# Altium project TRACER_GBOX.PrjPcb
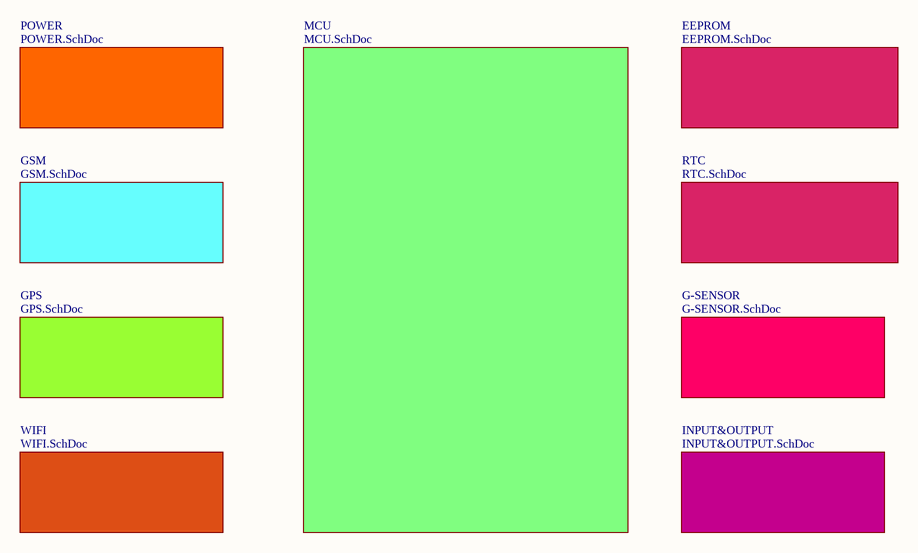
[diagram p0: TRACER_GBOX.SchDoc]
10 sheets, 122 parts. Net scope: flat (ports and power ports of the same name join across sheets).
Board file: TRACER_GBOX.PcbDoc
Sheets:
  TRACER_GBOX.SchDoc
    MCU = MCU.SchDoc
    EEPROM = EEPROM.SchDoc
    RTC = RTC.SchDoc
    GPS = GPS.SchDoc
    GSM = GSM.SchDoc
    G-SENSOR = G-SENSOR.SchDoc
    POWER = POWER.SchDoc
    INPUT&OUTPUT = INPUT&OUTPUT.SchDoc
    WIFI = WIFI.SchDoc

## Sheet TRACER_GBOX.SchDoc
size A4

### Sub-sheets
EEPROM = EEPROM.SchDoc: no entries
G-SENSOR = G-SENSOR.SchDoc: no entries
GPS = GPS.SchDoc: no entries
GSM = GSM.SchDoc: no entries
INPUT&OUTPUT = INPUT&OUTPUT.SchDoc: no entries
MCU = MCU.SchDoc: no entries
POWER = POWER.SchDoc: no entries
RTC = RTC.SchDoc: no entries
WIFI = WIFI.SchDoc: no entries

## Sheet MCU.SchDoc
size A4
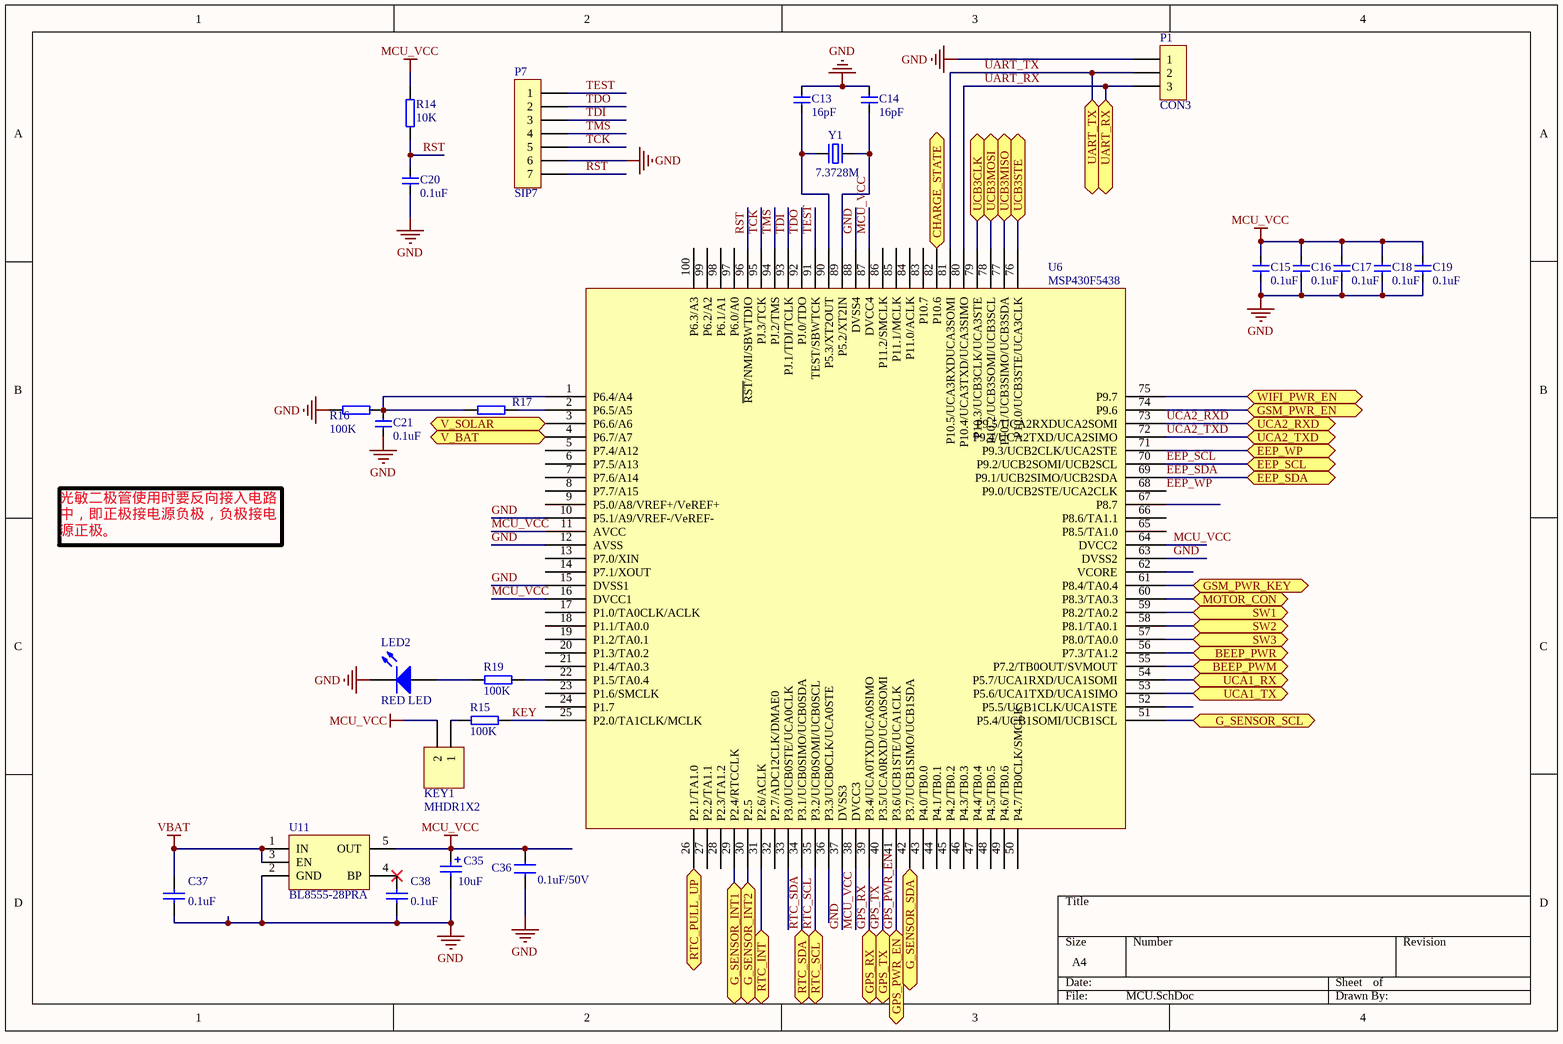
[diagram p1: MCU.SchDoc]

### Parts
C13  16pF  [0603C]
C14  16pF  [0603C]
C15  0.1uF  [0603C]
C16  0.1uF  [0603C]
C17  0.1uF  [0603C]
C18  0.1uF  [0603C]
C19  0.1uF  [0603C]
C20  0.1uF  [0603C]
C21  0.1uF  [0603C]
C35  10uF  [CAP1210]
C36  0.1uF/50V  [0603C]
C37  0.1uF  [0603C]
C38  0.1uF  [0603C]
KEY1  MHDR1X2  [MHDR1X2]
LED2  RED LED  [LED-0603]
P1  CON3  [HDR1X3]
P7  SIP7  [HDR1X7]
R14  10K  [0603R]
R15  100K  [0603R]
R16  100K  [0603R]
R17  200K  [0603R]
R19  100K  [0603R]
U6  MSP430F5438  [LQFP-100_14x14x05P]
U11  BL8555-28PRA  [SOT23-5]
Y1  7.3728M  [5032SMD]

### Ports
BEEP_PWM, BEEP_PWR, CHARGE_STATE, EEP_SCL, EEP_SDA, EEP_WP, G_SENSOR_INT1, G_SENSOR_INT2, G_SENSOR_SCL, G_SENSOR_SDA, GPS_PWR_EN, GPS_RX, GPS_TX, GSM_PWR_EN, GSM_PWR_KEY, MOTOR_CON, RTC_INT (bidir), RTC_PULL_UP, RTC_SCL, RTC_SDA, SW1, SW2, SW3, UART_RX, UART_TX, UCA1_RX, UCA1_TX, UCA2_RXD, UCA2_TXD, UCB3CLK, UCB3MISO, UCB3MOSI, UCB3STE, V_BAT, V_SOLAR, WIFI_PWR_EN

### Nets
GND: C13.1 C14.1 C15.1 C16.1 C17.1 C18.1 C19.1 C20.1 C21.2 C35.2 C36.2 C37.1 C38.1 LED2.2(K) P1.1 P7.6 R16.1 U6.10(P5.1/A9/VREF-/VeREF-) U6.12(AVSS) U6.15(DVSS1) U6.37(DVSS3) U6.63(DVSS2) U6.88(DVSS4) U11.2(GND)
MCU_VCC: C15.2 C16.2 C17.2 C18.2 C19.2 C35.1 C36.1 KEY1.2 R14.2 U6.11(AVCC) U6.16(DVCC1) U6.38(DVCC3) U6.64(DVCC2) U6.87(DVCC4) U11.5(OUT)
VBAT: C37.2 U11.1(IN) U11.3(EN)
BEEP_PWM: U6.55(P7.2/TB0OUT/SVMOUT) ; port BEEP_PWM
BEEP_PWR: U6.56(P7.3/TA1.2) ; port BEEP_PWR
EEP_SCL: U6.70(P9.2/UCB2SOMI/UCB2SCL) ; port EEP_SCL
EEP_SDA: U6.69(P9.1/UCB2SIMO/UCB2SDA) ; port EEP_SDA
EEP_WP: U6.68(P9.0/UCB2STE/UCA2CLK)
G_SENSOR_INT1: U6.29(P2.4/RTCCLK) ; port G_SENSOR_INT1
G_SENSOR_INT2: U6.30(P2.5) ; port G_SENSOR_INT2
GPS_PWR_EN: U6.41(P3.6/UCB1STE/UCA1CLK) ; port GPS_PWR_EN
GPS_RX: U6.39(P3.4/UCA0TXD/UCA0SIMO) ; port GPS_RX
GPS_TX: U6.40(P3.5/UCA0RXD/UCA0SOMI) ; port GPS_TX
GSM_PWR_EN: U6.74(P9.6) ; port GSM_PWR_EN
GSM_PWR_KEY: U6.61(P8.4/TA0.4) ; port GSM_PWR_KEY
KEY: R15.2 U6.25(P2.0/TA1CLK/MCLK)
MOTOR_CON: U6.60(P8.3/TA0.3) ; port MOTOR_CON
RST: C20.2 P7.7 R14.1 U6.96(~{RST}/NMI/SBWTDIO)
RTC_INT: U6.31(P2.6/ACLK) ; port RTC_INT
RTC_PULL_UP: U6.26(P2.1/TA1.0) ; port RTC_PULL_UP
RTC_SCL: U6.35(P3.2/UCB0SOMI/UCB0SCL) ; port RTC_SCL
RTC_SDA: U6.34(P3.1/UCB0SIMO/UCB0SDA) ; port RTC_SDA
TCK: P7.5 U6.95(PJ.3/TCK)
TDI: P7.3 U6.93(PJ.1/TDI/TCLK)
TDO: P7.2 U6.92(PJ.0/TDO)
TEST: P7.1 U6.91(TEST/SBWTCK)
TMS: P7.4 U6.94(PJ.2/TMS)
UART_RX: P1.3 U6.80(P10.4/UCA3TXD/UCA3SIMO) ; port UART_RX
UART_TX: P1.2 U6.81(P10.5/UCA3RXDUCA3SOMI) ; port UART_TX
UCA2_RXD: U6.73(P9.5/UCA2RXDUCA2SOMI) ; port UCA2_RXD
UCA2_TXD: U6.72(P9.4/UCA2TXD/UCA2SIMO) ; port UCA2_TXD
NetC1_2: U6.71(P9.3/UCB2CLK/UCA2STE) ; port EEP_WP
NetC13_2: C13.2 U6.90(P5.3/XT2OUT) Y1.1
NetC14_2: C14.2 U6.89(P5.2/XT2IN) Y1.2
NetC21_1: C21.1 R16.2 R17.1 U6.1(P6.4/A4)
NetC23_2: U6.3(P6.6/A6) ; port V_SOLAR
NetC28_1: U6.59(P8.2/TA0.2) ; port SW1
NetC29_1: U6.58(P8.1/TA0.1) ; port SW2
NetC30_1: U6.57(P8.0/TA0.0) ; port SW3
NetC38_2: C38.2 U11.4(BP)
NetC39_2: U6.4(P6.7/A7) ; port V_BAT
NetKEY1_1: KEY1.1 R15.1
NetLED2_1: LED2.1(A) R19.1
NetR17_2: R17.2 U6.2(P6.5/A5)
NetR19_2: R19.2 U6.22(P1.5/TA0.4)
NetR20_2: U6.75(P9.7) ; port WIFI_PWR_EN
NetR41_2: U6.51(P5.4/UCB1SOMI/UCB1SCL) ; port G_SENSOR_SCL
NetR42_2: U6.42(P3.7/UCB1SIMO/UCB1SDA) ; port G_SENSOR_SDA
NetRA1_5: U6.79(P10.3/UCB3CLK/UCA3STE) ; port UCB3CLK
NetRA1_6: U6.78(P10.2/UCB3SOMI/UCB3SCL) ; port UCB3MOSI
NetRA1_7: U6.77(P10.1/UCB3SIMO/UCB3SDA) ; port UCB3MISO
NetRA1_8: U6.76(P10.0/UCB3STE/UCA3CLK) ; port UCB3STE
NetU6_53: U6.53(P5.6/UCA1TXD/UCA1SIMO) ; port UCA1_TX
NetU6_54: U6.54(P5.7/UCA1RXD/UCA1SOMI) ; port UCA1_RX
NetU6_82: U6.82(P10.6) ; port CHARGE_STATE

Not connected (* = marked no-connect by the designer): U6 5(P7.4/A12) 6(P7.5/A13) 7(P7.6/A14) 8(P7.7/A15) 9(P5.0/A8/VREF+/VeREF+) 13(P7.0/XIN) 14(P7.1/XOUT) 17(P1.0/TA0CLK/ACLK) 18(P1.1/TA0.0) 19(P1.2/TA0.1) 20(P1.3/TA0.2) 21(P1.4/TA0.3) 23(P1.6/SMCLK) 24(P1.7) 27(P2.2/TA1.1) 28(P2.3/TA1.2) 32(P2.7/ADC12CLK/DMAE0) 33(P3.0/UCB0STE/UCA0CLK) 36(P3.3/UCB0CLK/UCA0STE) 43(P4.0/TB0.0) 44(P4.1/TB0.1) 45(P4.2/TB0.2) 46(P4.3/TB0.3) 47(P4.4/TB0.4) 48(P4.5/TB0.5) 49(P4.6/TB0.6) 50(P4.7/TB0CLK/SMCLK) 52(P5.5/UCB1CLK/UCA1STE) 62(VCORE) 65(P8.5/TA1.0) 66(P8.6/TA1.1) 67(P8.7) 83(P10.7) 84(P11.0/ACLK) 85(P11.1/MCLK) 86(P11.2/SMCLK) 97(P6.0/A0) 98(P6.1/A1) 99(P6.2/A2) 100(P6.3/A3)

### Notes on the sheet
- 光敏二极管使用时要反向接入电路中，即正极接电源负极，负极接电源正极。

### Library data of the parts
C13-C21 C36 = CAP
C35 = Cap Pol: Polarized Capacitor (Radial); Published: 8-Jun-2000; LatestRevisionDate: 17-Jul-2002; LatestRevisionNote: Re-released for DXP Platform.; Publisher: Altium Limited; Value: 10uF
C37 C38 = Cap: Capacitor; Value: 104; Published: 8-Jun-2000; LatestRevisionDate: 17-Jul-2002; LatestRevisionNote: Re-released for DXP Platform.; Publisher: Altium Limited
KEY1 = MHDR1X2: Header, 2-Pin; LatestRevisionDate: 17-Jul-2002; LatestRevisionNote: Re-released for DXP Platform.; Publisher: Altium Limited
LED2 = LED3: 红色LED; Published: 8-Jun-2000; LatestRevisionDate: 17-Dec-2003; LatestRevisionNote: PCB Footprint replaced.; DatasheetDocument: 16-Apr-2002; PackageDocument: 16-Apr-2002; PackageReference: 3.5X2.8X1.9; Publisher: Altium Limited
P1 = CON3: Connector
P7 = COM7
R14-R17 R19 = RES2A
U6 = MSP430F5438A
U11 = SGM2019
Y1 = CRYSTAL0.3: 5032 SMD 无源2pin

## Sheet EEPROM.SchDoc
size A4
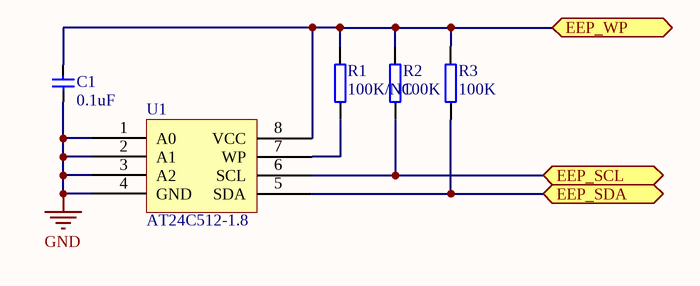
[diagram p2: EEPROM.SchDoc]

### Parts
C1  0.1uF  [0603C]
R1  100K/NC  [0603R]
R2  100K  [0603R]
R3  100K  [0603R]
U1  AT24C512-1.8  [SOP8]

### Ports
EEP_SCL, EEP_SDA, EEP_WP

### Nets
GND: C1.1 U1.1(A0) U1.2(A1) U1.3(A2) U1.4(GND)
EEP_SCL: R2.2 U1.6(SCL) ; port EEP_SCL
EEP_SDA: R3.2 U1.5(SDA) ; port EEP_SDA
NetC1_2: C1.2 R1.2 R2.1 R3.1 U1.8(VCC) ; port EEP_WP
NetR1_1: R1.1 U1.7(WP)

### Library data of the parts
C1 = CAP
R1-R3 = RES2A

## Sheet RTC.SchDoc
size A4
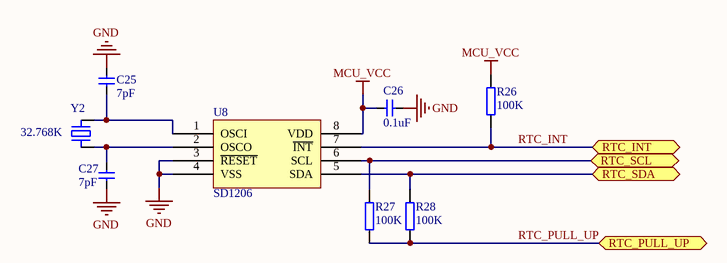
[diagram p3: RTC.SchDoc]

### Parts
C25  7pF  [0603C]
C26  0.1uF  [0603C]
C27  7pF  [0603C]
R26  100K  [0603R]
R27  100K  [0603R]
R28  100K  [0603R]
U8  SD1206  [SOP8]
Y2  32.768K  [3215SMD]

### Ports
RTC_INT, RTC_PULL_UP, RTC_SCL, RTC_SDA

### Nets
GND: C25.1 C26.2 C27.1 U8.3(~{RESET}) U8.4(VSS)
MCU_VCC: C26.1 R26.2 U8.8(VDD)
RTC_INT: R26.1 U8.7(~{INT}) ; port RTC_INT
RTC_PULL_UP: R27.1 R28.1 ; port RTC_PULL_UP
RTC_SCL: R27.2 U8.6(SCL) ; port RTC_SCL
RTC_SDA: R28.2 U8.5(SDA) ; port RTC_SDA
NetC25_2: C25.2 U8.1(OSCI) Y2.1
NetC27_2: C27.2 U8.2(OSCO) Y2.2

### Library data of the parts
C25-C27 = CAP
R26-R28 = RES2A
U8 = PCF8593
Y2 = CRYSTAL_2P: 无源贴片晶振 3215 2脚  FC-135

## Sheet GPS.SchDoc
size A4
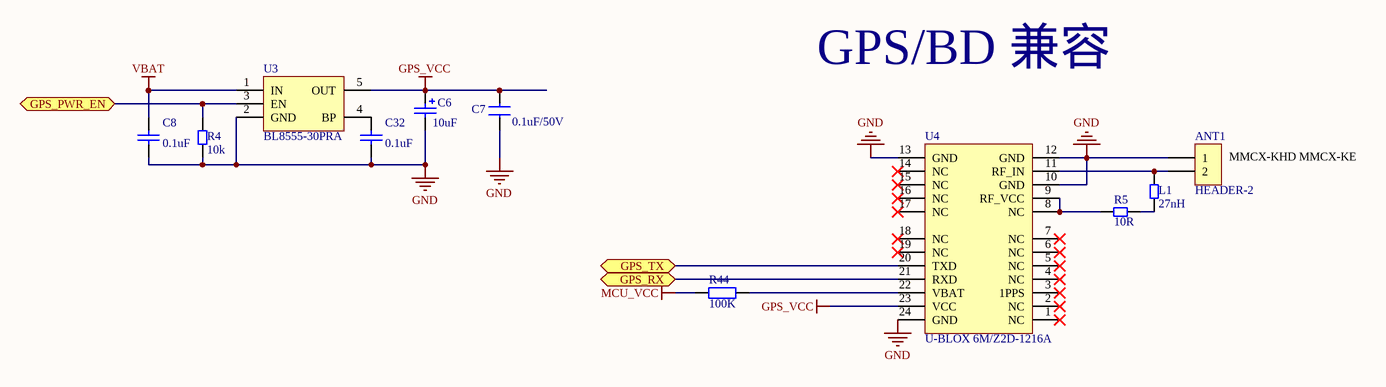
[diagram p4: GPS.SchDoc]

### Parts
ANT1  HEADER-2  [IPEX]
C6  10uF  [CAP1210]
C7  0.1uF/50V  [0603C]
C8  0.1uF  [0603C]
C32  0.1uF  [0603C]
L1  27nH  [0603R]
R4  10k  [0603R]
R5  10R  [1206R]
R44  100K  [0603R]
U3  BL8555-30PRA  [SOT23-5]
U4  U-BLOX 6M/Z2D-1216A  [G_UBLOXNEO5]

### Ports
GPS_PWR_EN, GPS_RX, GPS_TX

### Nets
GND: ANT1.1 C6.2 C7.2 C8.1 C32.1 R4.1 U3.2(GND) U4.10(GND) U4.12(GND) U4.13(GND) U4.24(GND)
GPS_VCC: C6.1 C7.1 U3.5(OUT) U4.23(VCC)
MCU_VCC: R44.1
VBAT: C8.2 U3.1(IN)
GPS_PWR_EN: R4.2 U3.3(EN) ; port GPS_PWR_EN
GPS_RX: U4.21(RXD) ; port GPS_RX
GPS_TX: U4.20(TXD) ; port GPS_TX
NetANT1_2: ANT1.2 L1.2 U4.11(RF_IN)
NetC32_2: C32.2 U3.4(BP)
NetL1_1: L1.1 R5.2
NetR5_1: R5.1 U4.8(NC) U4.9(RF_VCC)
NetR44_2: R44.2 U4.22(VBAT)

Not connected (* = marked no-connect by the designer): U4 1(NC)* 2(NC)* 3(1PPS)* 4(NC)* 5(NC)* 6(NC)* 7(NC)* 14(NC)* 15(NC)* 16(NC)* 17(NC)* 18(NC)* 19(NC)*

### Notes on the sheet
- GPS/BD 兼容
- (near ANT1) MMCX-KHD MMCX-KE

### Library data of the parts
C6 = Cap Pol: Polarized Capacitor (Radial); Published: 8-Jun-2000; LatestRevisionDate: 17-Jul-2002; LatestRevisionNote: Re-released for DXP Platform.; Publisher: Altium Limited; Value: 10uF
C7 = CAP
C8 C32 = Cap: Capacitor; Value: 104; Published: 8-Jun-2000; LatestRevisionDate: 17-Jul-2002; LatestRevisionNote: Re-released for DXP Platform.; Publisher: Altium Limited
L1 R4 R5 = Res2: Resistor; Value: 1K; Published: 8-Jun-2000; LatestRevisionDate: 17-Jul-2002; LatestRevisionNote: Re-released for DXP Platform.; Publisher: Altium Limited
R44 = 0603R
U3 = SGM2019
U4 = XBDM-1612

## Sheet GSM.SchDoc
size A4
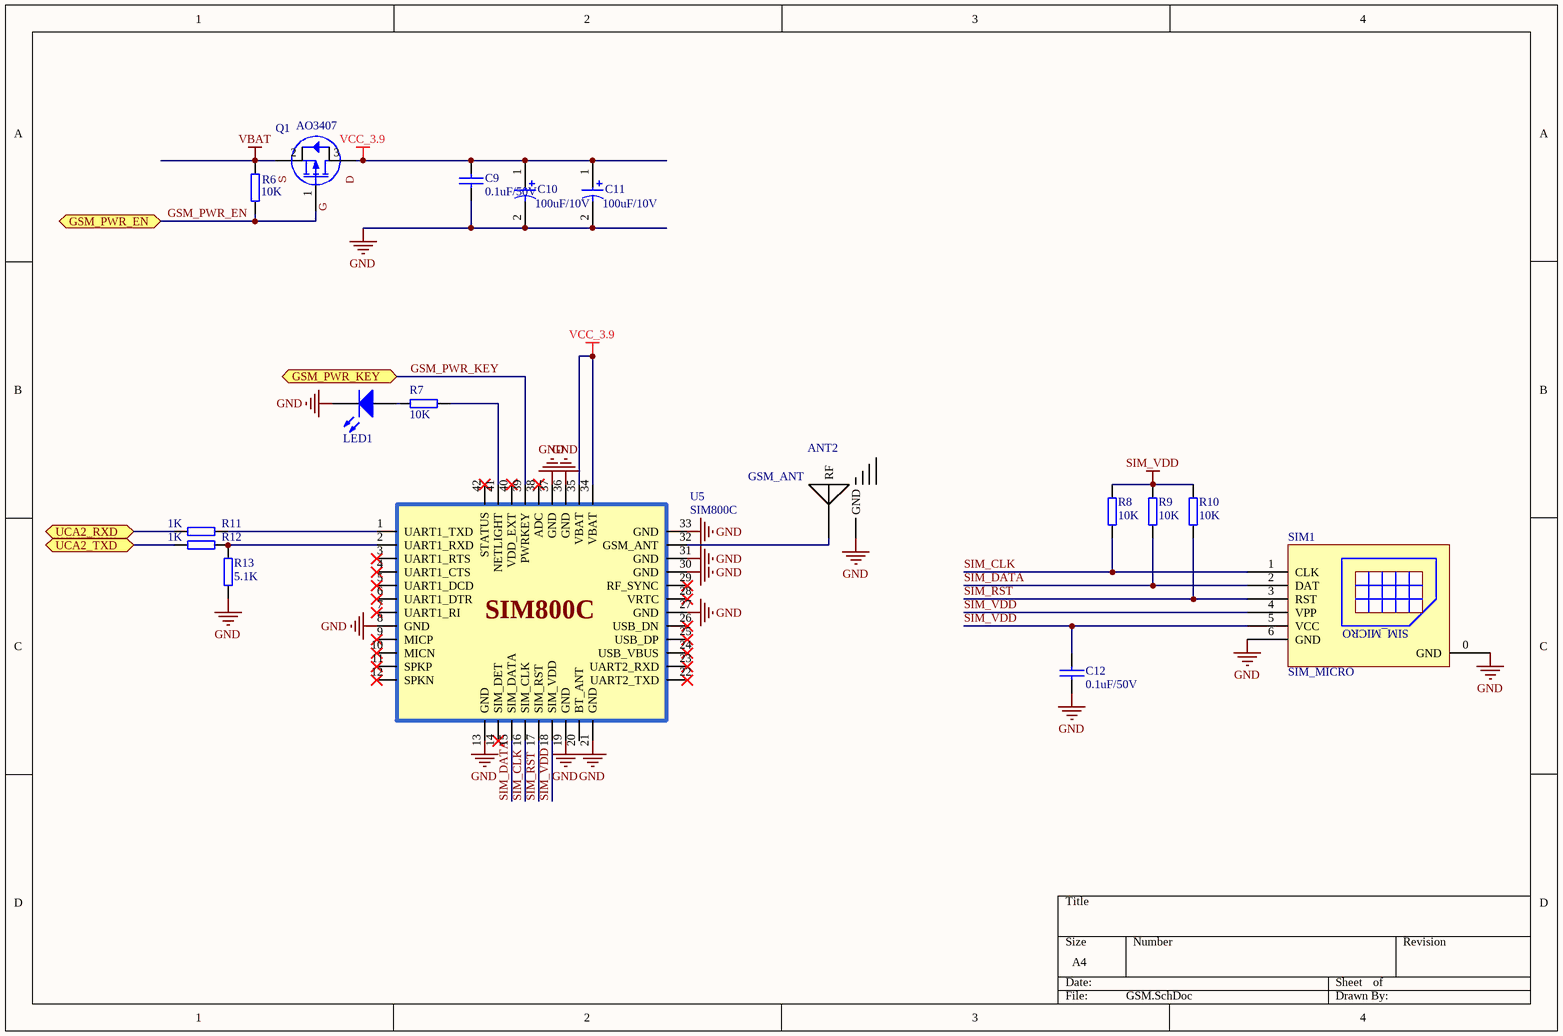
[diagram p5: GSM.SchDoc]

### Parts
ANT2  GSM_ANT  [IPEX]
C9  0.1uF/50V  [0603C]
C10  100uF/10V  [CAPTANC]
C11  100uF/10V  [CAPTANC]
C12  0.1uF/50V  [0603C]
LED1  YLED  [LED-0603]  (value not drawn)
Q1  AO3407  [SOT23]
R6  10K  [0603R]
R7  10K  [0603R]
R8  10K  [0603R]
R9  10K  [0603R]
R10  10K  [0603R]
R11  1K  [0603R]
R12  1K  [0603R]
R13  5.1K  [0603R]
SIM1  SIM_MICRO  [SIM_MICRO]
U5  SIM800C  [SIM800C]

### Ports
GSM_PWR_EN, GSM_PWR_KEY, UCA2_RXD, UCA2_TXD

### Nets
GND: ANT2.1(GND) C9.2 C10.2 C11.2 C12.2 LED1.2(K) R13.2 SIM1.0(GND) SIM1.6(GND) U5.8(GND) U5.13(GND) U5.19(GND) U5.21(GND) U5.27(GND) U5.30(GND) U5.31(GND) U5.33(GND) U5.36(GND) U5.37(GND)
SIM_VDD: C12.1 R8.1 R9.1 R10.1 SIM1.4(VPP) SIM1.5(VCC) U5.18(SIM_VDD)
VBAT: Q1.2(S) R6.1
VCC_3.9: C9.1 C10.1 C11.1 Q1.3(D) U5.34(VBAT) U5.35(VBAT)
GSM_PWR_EN: Q1.1(G) R6.2 ; port GSM_PWR_EN
GSM_PWR_KEY: U5.39(PWRKEY) ; port GSM_PWR_KEY
SIM_CLK: R8.2 SIM1.1(CLK) U5.16(SIM_CLK)
SIM_DATA: R9.2 SIM1.2(DAT) U5.15(SIM_DATA)
SIM_RST: R10.2 SIM1.3(RST) U5.17(SIM_RST)
UCA2_RXD: R11.1 ; port UCA2_RXD
UCA2_TXD: R12.1 ; port UCA2_TXD
NetANT2_2: ANT2.2(RF) U5.32(GSM_ANT)
NetLED1_1: LED1.1(A) R7.2
NetR7_1: R7.1 U5.41(NETLIGHT)
NetR11_2: R11.2 U5.1(UART1_TXD)
NetR12_2: R12.2 R13.1 U5.2(UART1_RXD)

Not connected (* = marked no-connect by the designer): U5 3(UART1_RTS)* 4(UART1_CTS)* 5(UART1_DCD)* 6(UART1_DTR)* 7(UART1_RI)* 9(MICP)* 10(MICN)* 11(SPKP)* 12(SPKN)* 14(SIM_DET)* 20(BT_ANT) 22(UART2_TXD)* 23(UART2_RXD)* 24(USB_VBUS)* 25(USB_DP)* 26(USB_DN)* 28(VRTC)* 29(RF_SYNC)* 38(ADC)* 40(VDD_EXT)* 42(STATUS)*

### Library data of the parts
ANT2 = GSM_ANT_1: passive_antenna
C9 = CAP: Capacitor
C10 C11 = CAP2
C12 = 0603C
LED1 = LED3: BLUE LED; Published: 8-Jun-2000; LatestRevisionDate: 17-Dec-2003; LatestRevisionNote: PCB Footprint replaced.; DatasheetDocument: 16-Apr-2002; PackageDocument: 16-Apr-2002; PackageReference: 3.5X2.8X1.9; Publisher: Altium Limited
Q1 = AO3401: P-Channel MOSFET; Published: 8-Jun-2000; LatestRevisionDate: 17-Jul-2002; LatestRevisionNote: Re-released for DXP Platform.; PackageVersion: 1995/1996; PackageReference: E3; Publisher: Altium Limited; PackageDescription: TO, Flat Index; 3 In-Line, Axial Leads; Body Dia. 4.6mm; Lead Dia. 0.5 mm (max)
R6-R13 = RES2A

## Sheet G-SENSOR.SchDoc
size A4
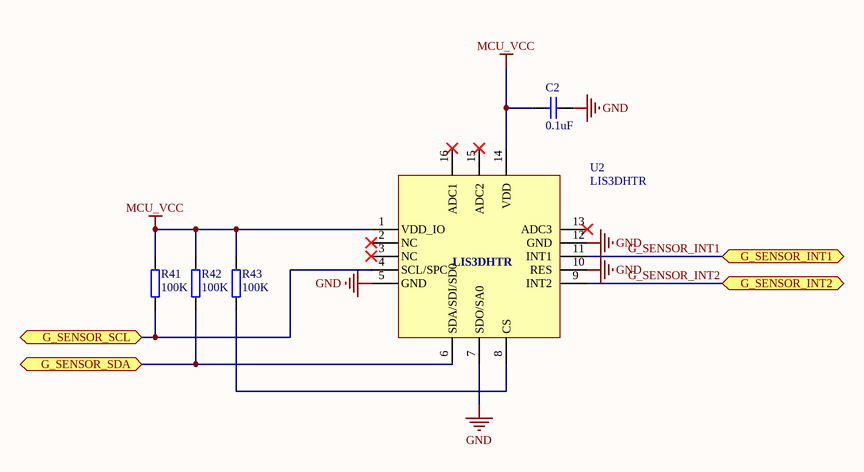
[diagram p6: G-SENSOR.SchDoc]

### Parts
C2  0.1uF  [0603C]
R41  100K  [0603R]
R42  100K  [0603R]
R43  100K  [0603R]
U2  LIS3DHTR  [LC-LGA-16_3x3mm]

### Ports
G_SENSOR_INT1, G_SENSOR_INT2, G_SENSOR_SCL, G_SENSOR_SDA

### Nets
GND: C2.1 U2.5(GND) U2.7(SDO/SA0) U2.10(RES) U2.12(GND)
MCU_VCC: C2.2 R41.1 R42.1 R43.1 U2.1(VDD_IO) U2.14(VDD)
G_SENSOR_INT1: U2.11(INT1) ; port G_SENSOR_INT1
G_SENSOR_INT2: U2.9(INT2) ; port G_SENSOR_INT2
NetR41_2: R41.2 U2.4(SCL/SPC) ; port G_SENSOR_SCL
NetR42_2: R42.2 U2.6(SDA/SDI/SD0) ; port G_SENSOR_SDA
NetR43_2: R43.2 U2.8(CS)

Not connected (* = marked no-connect by the designer): U2 2(NC)* 3(NC)* 13(ADC3)* 15(ADC2)* 16(ADC1)*

### Library data of the parts
C2 = Cap: Capacitor; Value: 104; Published: 8-Jun-2000; LatestRevisionDate: 17-Jul-2002; LatestRevisionNote: Re-released for DXP Platform.; Publisher: Altium Limited
R41-R43 = RES2A

## Sheet POWER.SchDoc
size A4
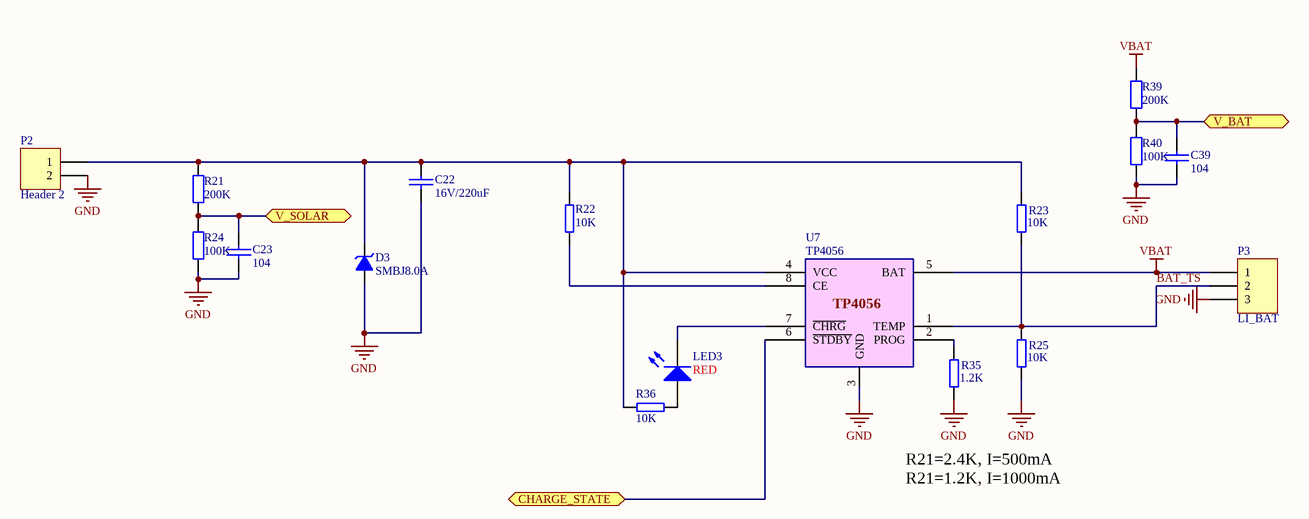
[diagram p7: POWER.SchDoc]

### Parts
C22  16V/220uF  [CAP1210]
C23  104  [0603C]
C39  104  [0603C]
D3  SMBJ8.0A  [DO-214AA]
LED3  RED  [LED-0603]
P2  Header 2  [HEADER_2WAY_2.54MM]
P3  LI_BAT  [HDR1X3_1.25mm]
R21  200K  [0603R]
R22  10K  [0603R]
R23  10K  [0603R]
R24  100K  [0603R]
R25  10K  [0603R]
R35  1.2K  [0603R]
R36  10K  [0603R]
R39  200K  [0603R]
R40  100K  [0603R]
U7  TP4056  [TP4056]

### Ports
CHARGE_STATE, V_BAT, V_SOLAR

### Nets
GND: C22.2 C23.1 C39.1 D3.1(A) P2.2 P3.3 R24.2 R25.2 R35.2 R40.2 U7.3(GND)
VBAT: P3.1 R39.1 U7.5(BAT)
BAT_TS: P3.2 R23.2 R25.1 U7.1(TEMP)
NetC22_1: C22.1 D3.2(K) P2.1 R21.1 R22.2 R23.1 R36.1 U7.4(VCC)
NetC23_2: C23.2 R21.2 R24.1 ; port V_SOLAR
NetC39_2: C39.2 R39.2 R40.1 ; port V_BAT
NetLED3_1: LED3.1(A) R36.2
NetLED3_2: LED3.2(K) U7.7(~{CHRG})
NetR22_1: R22.1 U7.8(CE)
NetR35_1: R35.1 U7.2(PROG)
NetU6_82: U7.6(~{STDBY}) ; port CHARGE_STATE

### Notes on the sheet
- R21=2.4K, I=500mA
  R21=1.2K, I=1000mA

### Library data of the parts
C22 C23 C39 = 0603C
D3 = D Zener: Zener Diode; Published: 8-Jun-2000; LatestRevisionDate: 17-Jul-2002; LatestRevisionNote: Re-released for DXP Platform.; Publisher: Altium Limited
LED3 = LED3: RED LED; Published: 8-Jun-2000; LatestRevisionDate: 17-Dec-2003; LatestRevisionNote: PCB Footprint replaced.; DatasheetDocument: 16-Apr-2002; PackageDocument: 16-Apr-2002; PackageReference: 3.5X2.8X1.9; Publisher: Altium Limited
P2 = Header 2: Header, 2-Pin; LatestRevisionDate: 17-Jul-2002; LatestRevisionNote: Re-released for DXP Platform.; Publisher: Altium Limited
P3 = Header 3: Header, 3-Pin; LatestRevisionDate: 17-Jul-2002; LatestRevisionNote: Re-released for DXP Platform.; Publisher: Altium Limited
R21 R24 R39 R40 = 0603R
R22 R23 R25 R35 R36 = RES2A

## Sheet INPUT&OUTPUT.SchDoc
size A4
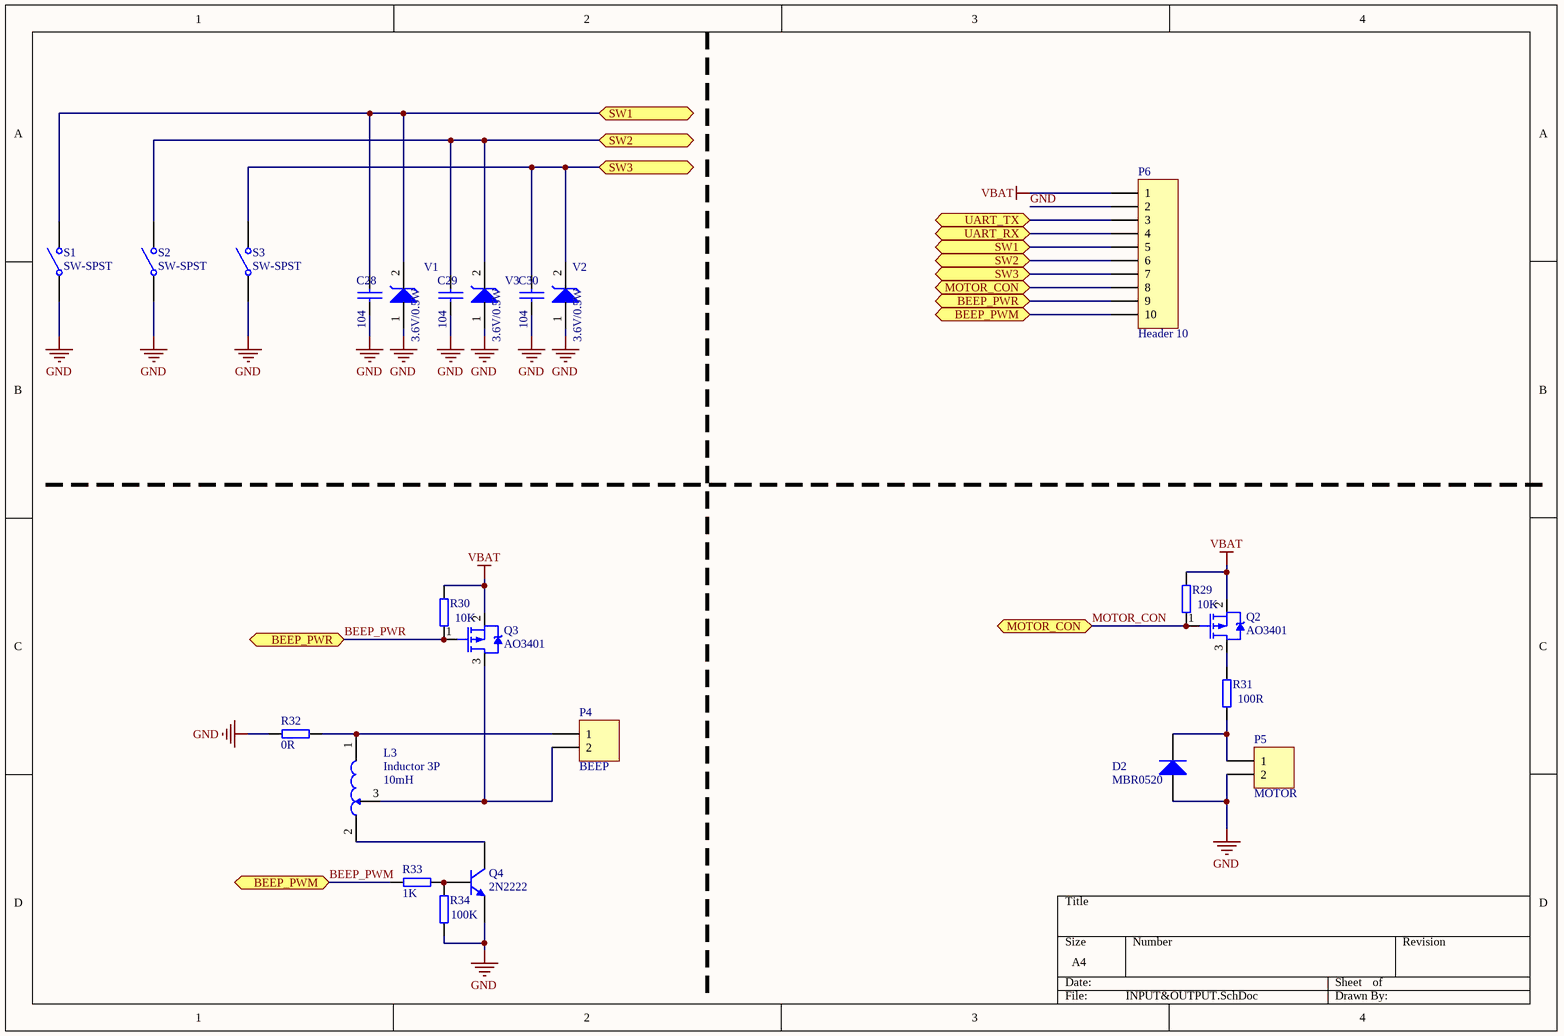
[diagram p8: INPUT&OUTPUT.SchDoc]

### Parts
C28  104  [0603C]
C29  104  [0603C]
C30  104  [0603C]
D2  MBR0520  [1206D]
L3  Inductor 3P  value 10mH  [HDR1X3 W]
P4  BEEP  [XH2.54-2P]
P5  MOTOR  [XH2.54-2P]
P6  Header 10  [HDR1X10]
Q2  AO3401  [sot23]
Q3  AO3401  [SOT23]
Q4  2N2222  [sot23]
R29  10K  [0603R]
R30  10K  [0603R]
R31  100R  [0603R]
R32  0R  [0603R]
R33  1K  [0603R]
R34  100K  [0603R]
S1  SW-SPST  [XH2.54-2P]
S2  SW-SPST  [XH2.54-2P]
S3  SW-SPST  [XH2.54-2P]
V1  3.6V/0.5W  [1206D]
V2  3.6V/0.5W  [1206D]
V3  3.6V/0.5W  [1206D]

### Ports
BEEP_PWM, BEEP_PWR, MOTOR_CON, SW1, SW2, SW3, UART_RX, UART_TX

### Nets
GND: C28.2 C29.2 C30.2 D2.1(A) P5.2 P6.2 Q4.1(E) R32.1 R34.2 S1.1(COMMON) S2.1(COMMON) S3.1(COMMON) V1.1 V2.1 V3.1
VBAT: P6.1 Q2.2(S) Q3.2(S) R29.1 R30.1
BEEP_PWM: P6.10 R33.1 ; port BEEP_PWM
BEEP_PWR: P6.9 Q3.1(G) R30.2 ; port BEEP_PWR
MOTOR_CON: P6.8 Q2.1(G) R29.2 ; port MOTOR_CON
UART_RX: P6.4 ; port UART_RX
UART_TX: P6.3 ; port UART_TX
NetC28_1: C28.1 P6.5 S1.2(NO) V1.2 ; port SW1
NetC29_1: C29.1 P6.6 S2.2(NO) V3.2 ; port SW2
NetC30_1: C30.1 P6.7 S3.2(NO) V2.2 ; port SW3
NetD2_2: D2.2(K) P5.1 R31.2
NetL3_1: L3.1 P4.1 R32.2
NetL3_2: L3.2 Q4.3(C)
NetL3_3: L3.3 P4.2 Q3.3(D)
NetQ2_3: Q2.3(D) R31.1
NetQ4_2: Q4.2(B) R33.2 R34.1

### Library data of the parts
C28-C30 = 0603C
D2 = Diode: Default Diode; Published: 8-Jun-2000; LatestRevisionDate: 17-Jul-2002; LatestRevisionNote: Re-released for DXP Platform.; PackageDocument: Sep-1996; PackageReference: SMC; Publisher: Altium Limited; Code_JEDEC: DO-214-AB
L3 = Inductor 3P: Adjustable Magnetic-Core Inductor; Set Position: 0.5; Published: 24-Mar-1999; LatestRevisionDate: 17-Jul-2002; LatestRevisionNote: Re-released for DXP Platform.; PackageReference: AXIAL-1.0; Publisher: Altium Limited; PackageDescription: Axial Device, Thru-Hole; 2 Leads; 1.0 in Pin Spacing
P4 P5 = MHDR1X2: Header, 2-Pin; LatestRevisionDate: 17-Jul-2002; LatestRevisionNote: Re-released for DXP Platform.; Publisher: Altium Limited
P6 = Header 10: Header, 10-Pin; LatestRevisionDate: 17-Jul-2002; LatestRevisionNote: Re-released for DXP Platform.; Publisher: Altium Limited
Q2 Q3 = IRF5NJ5305: HEXFET Power MOSFET; Published: *; DatasheetDocument: *; PackageDocument: *; PackageReference: *; Publisher: *
Q4 = 2N3904: NPN General Purpose Amplifier; Published: 8-Jun-2000; LatestRevisionDate: 15-Jan-2003; LatestRevisionNote: PCB Footprint 'BCY-W3/D4.7' replaced; DatasheetDocument: 1997; PackageDocument: Sep-1998; PackageReference: TO-92A; Publisher: Altium Limited; Code_JEDEC: TO-92A; ComponentLink1Description: Manufacturer Link; ComponentLink1URL: http://www.fairchildsemi.com/; ComponentLink2Description: Datasheet; ComponentLink2URL: http://www.fairchildsemi.com/ds/2N%2F2N3904.pdf
R29-R34 = RES2A
S1-S3 = SW-SPST: Single-Pole, Single-Throw Switch; Published: 24-Mar-1999; LatestRevisionDate: 17-Jul-2002; LatestRevisionNote: Re-released for DXP Platform.; PackageReference: SPST-2; Publisher: Altium Limited; PackageDescription: Switch; 2 Leads
V1-V3 = DIODE-SCHOTTKY: DIODE SCHOTTKY

## Sheet WIFI.SchDoc
size A4
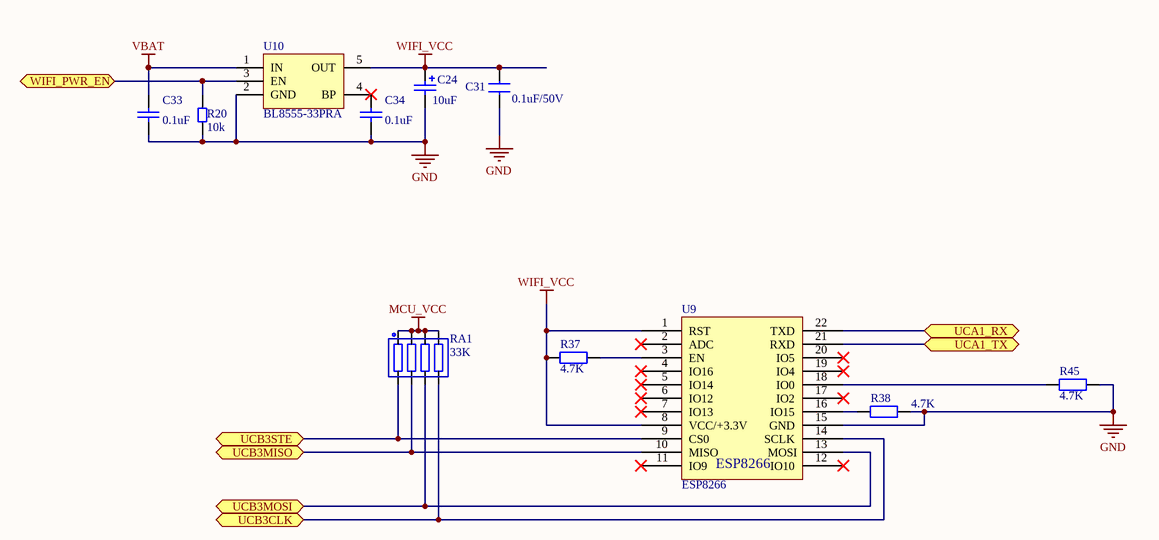
[diagram p9: WIFI.SchDoc]

### Parts
C24  10uF  [CAP1210]
C31  0.1uF/50V  [0603C]
C33  0.1uF  [0603C]
C34  0.1uF  [0603C]
R20  10k  [0603R]
R37  4.7K  [0603R]
R38  4.7K  [0603R]
R45  4.7K  [0603R]
RA1  33K  [RES_PACK_SMD_E]
U9  ESP8266  [ESP8266]
U10  BL8555-33PRA  [SOT23-5]

### Ports
UCA1_RX, UCA1_TX, UCB3CLK, UCB3MISO, UCB3MOSI, UCB3STE, WIFI_PWR_EN

### Nets
GND: C24.2 C31.2 C33.1 C34.1 R20.1 R38.2 R45.1 U9.15(GND) U10.2(GND)
MCU_VCC: RA1.1 RA1.2 RA1.3 RA1.4
VBAT: C33.2 U10.1(IN)
WIFI_VCC: C24.1 C31.1 R37.1 U9.1(RST) U9.8(VCC/+3.3V) U10.5(OUT)
NetC34_2: C34.2 U10.4(BP)
NetR20_2: R20.2 U10.3(EN) ; port WIFI_PWR_EN
NetR37_2: R37.2 U9.3(EN)
NetR38_1: R38.1 U9.16(IO15)
NetR45_2: R45.2 U9.18(IO0)
NetRA1_5: RA1.5 U9.14(SCLK) ; port UCB3CLK
NetRA1_6: RA1.6 U9.13(MOSI) ; port UCB3MOSI
NetRA1_7: RA1.7 U9.10(MISO) ; port UCB3MISO
NetRA1_8: RA1.8 U9.9(CS0) ; port UCB3STE
NetU6_53: U9.21(RXD) ; port UCA1_TX
NetU6_54: U9.22(TXD) ; port UCA1_RX

Not connected (* = marked no-connect by the designer): U9 2(ADC)* 4(IO16)* 5(IO14)* 6(IO12)* 7(IO13)* 11(IO9)* 12(IO10)* 17(IO2)* 19(IO4)* 20(IO5)*

### Library data of the parts
C24 = Cap Pol: Polarized Capacitor (Radial); Published: 8-Jun-2000; LatestRevisionDate: 17-Jul-2002; LatestRevisionNote: Re-released for DXP Platform.; Publisher: Altium Limited; Value: 10uF
C31 = CAP
C33 C34 = Cap: Capacitor; Value: 104; Published: 8-Jun-2000; LatestRevisionDate: 17-Jul-2002; LatestRevisionNote: Re-released for DXP Platform.; Publisher: Altium Limited
R20 = Res2: Resistor; Value: 1K; Published: 8-Jun-2000; LatestRevisionDate: 17-Jul-2002; LatestRevisionNote: Re-released for DXP Platform.; Publisher: Altium Limited
R37 R38 R45 = 0603R
RA1 = RESPACK4
U10 = SGM2019

## Nets that join several sheets
GND: MCU (24 pins), EEPROM (5 pins), RTC (5 pins), GPS (11 pins), GSM (19 pins), G-SENSOR (5 pins), POWER (11 pins), INPUT&OUTPUT (15 pins), WIFI (9 pins)
MCU_VCC: MCU (15 pins), RTC (C26.1 R26.2 U8.8), GPS (R44.1), G-SENSOR (6 pins), WIFI (RA1.1 RA1.2 RA1.3 RA1.4)
VBAT: MCU (C37.2 U11.1 U11.3), GPS (C8.2 U3.1), GSM (Q1.2 R6.1), POWER (P3.1 R39.1 U7.5), INPUT&OUTPUT (5 pins), WIFI (C33.2 U10.1)
BEEP_PWM: MCU (U6.55), INPUT&OUTPUT (P6.10 R33.1)
BEEP_PWR: MCU (U6.56), INPUT&OUTPUT (P6.9 Q3.1 R30.2)
EEP_SCL: MCU (U6.70), EEPROM (R2.2 U1.6)
EEP_SDA: MCU (U6.69), EEPROM (R3.2 U1.5)
G_SENSOR_INT1: MCU (U6.29), G-SENSOR (U2.11)
G_SENSOR_INT2: MCU (U6.30), G-SENSOR (U2.9)
GPS_PWR_EN: MCU (U6.41), GPS (R4.2 U3.3)
GPS_RX: MCU (U6.39), GPS (U4.21)
GPS_TX: MCU (U6.40), GPS (U4.20)
GSM_PWR_EN: MCU (U6.74), GSM (Q1.1 R6.2)
GSM_PWR_KEY: MCU (U6.61), GSM (U5.39)
MOTOR_CON: MCU (U6.60), INPUT&OUTPUT (P6.8 Q2.1 R29.2)
NetC1_2: MCU (U6.71), EEPROM (5 pins)
NetC23_2: MCU (U6.3), POWER (C23.2 R21.2 R24.1)
NetC28_1: MCU (U6.59), INPUT&OUTPUT (C28.1 P6.5 S1.2 V1.2)
NetC29_1: MCU (U6.58), INPUT&OUTPUT (C29.1 P6.6 S2.2 V3.2)
NetC30_1: MCU (U6.57), INPUT&OUTPUT (C30.1 P6.7 S3.2 V2.2)
NetC39_2: MCU (U6.4), POWER (C39.2 R39.2 R40.1)
NetR20_2: MCU (U6.75), WIFI (R20.2 U10.3)
NetR41_2: MCU (U6.51), G-SENSOR (R41.2 U2.4)
NetR42_2: MCU (U6.42), G-SENSOR (R42.2 U2.6)
NetRA1_5: MCU (U6.79), WIFI (RA1.5 U9.14)
NetRA1_6: MCU (U6.78), WIFI (RA1.6 U9.13)
NetRA1_7: MCU (U6.77), WIFI (RA1.7 U9.10)
NetRA1_8: MCU (U6.76), WIFI (RA1.8 U9.9)
NetU6_53: MCU (U6.53), WIFI (U9.21)
NetU6_54: MCU (U6.54), WIFI (U9.22)
NetU6_82: MCU (U6.82), POWER (U7.6)
RTC_INT: MCU (U6.31), RTC (R26.1 U8.7)
RTC_PULL_UP: MCU (U6.26), RTC (R27.1 R28.1)
RTC_SCL: MCU (U6.35), RTC (R27.2 U8.6)
RTC_SDA: MCU (U6.34), RTC (R28.2 U8.5)
UART_RX: MCU (P1.3 U6.80), INPUT&OUTPUT (P6.4)
UART_TX: MCU (P1.2 U6.81), INPUT&OUTPUT (P6.3)
UCA2_RXD: MCU (U6.73), GSM (R11.1)
UCA2_TXD: MCU (U6.72), GSM (R12.1)